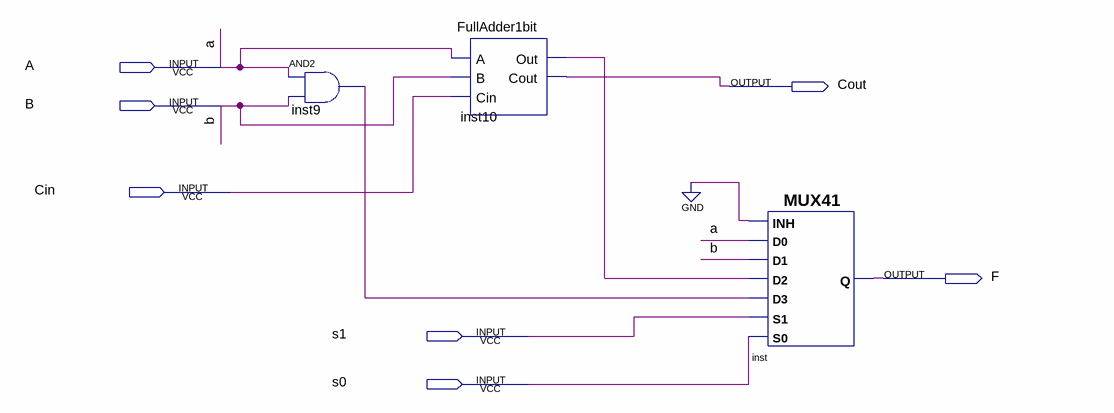
[diagram p0: schematic sheet]
// Quartus schematic ALU1bit.bdf as structural Verilog: 3 symbols, 7 pins
module ALU1bit (
  input  A,
  input  B,
  input  Cin,
  input  s1,
  input  s0,
  output Cout,
  output F
);

  wire inst9_out, inst10_out;

  and inst9 (inst9_out, A, B);
  FullAdder1bit inst10 (.A(A), .B(B), .Cin(Cin), .Out(inst10_out), .Cout(Cout));
  MUX41 inst (.S0(s0), .D2(inst10_out), .S1(s1), .D3(inst9_out), .D0(A), .INH(1'b0), .D1(B), .Q(F));
endmodule
